# Altium project motherboard2.PrjPcb
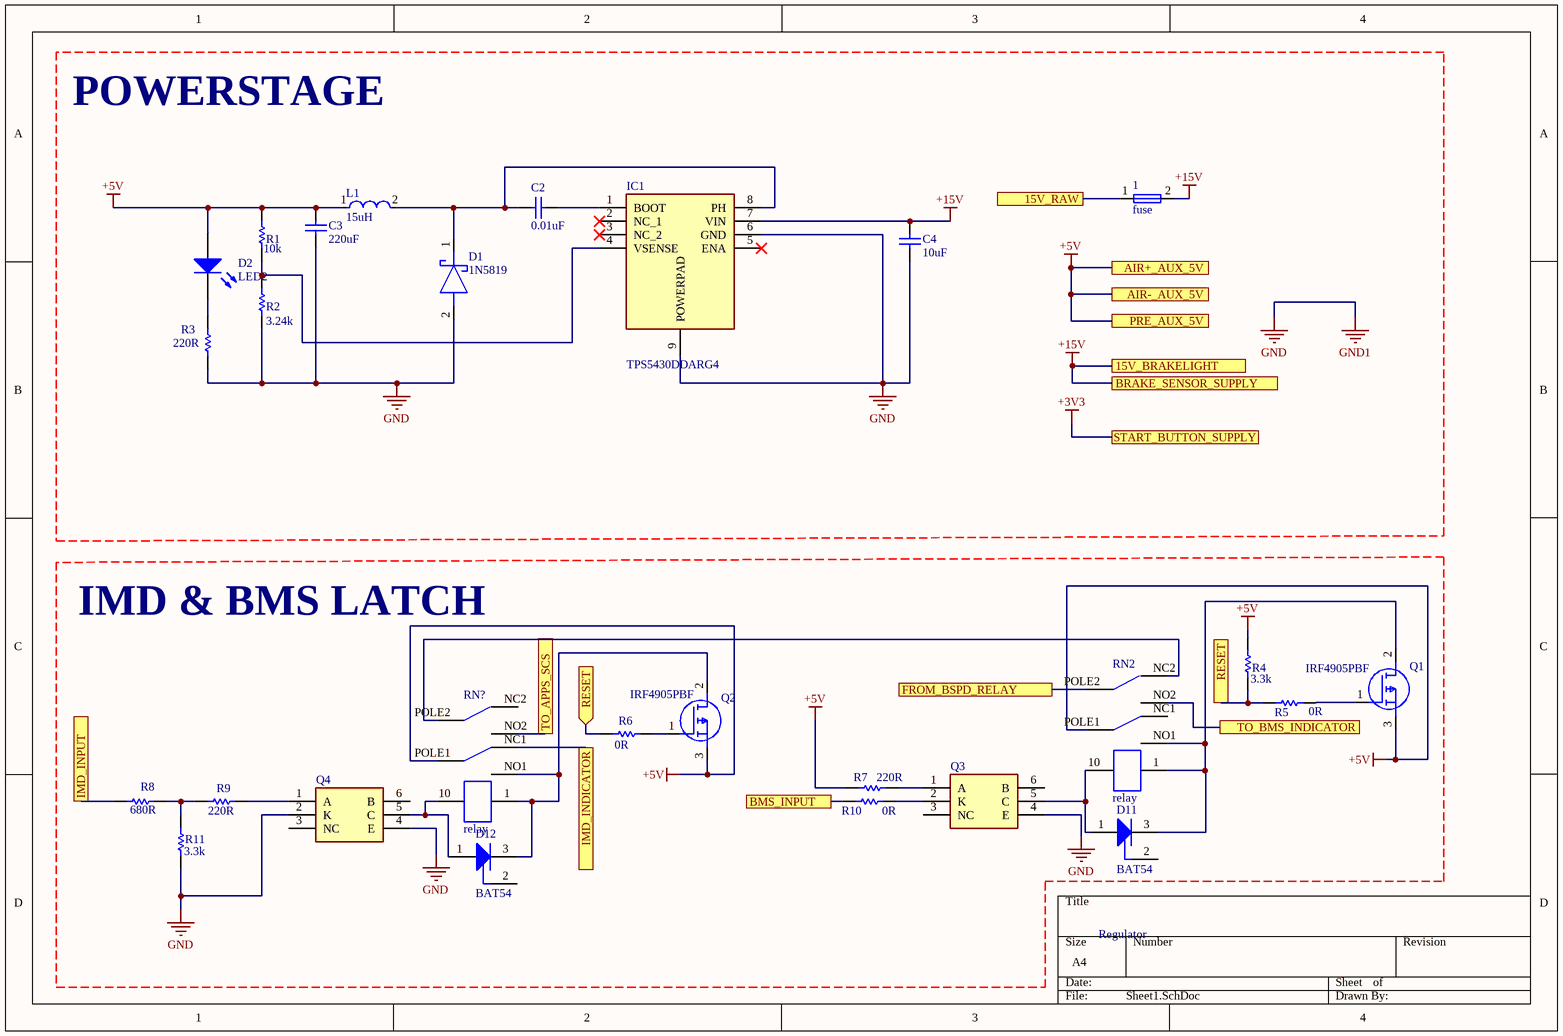
[diagram p0: Sheet1.SchDoc]
5 sheets, 112 parts. Net scope: flat (ports and power ports of the same name join across sheets).
Board file: PCB1.PcbDoc
Sheets:
  Sheet1.SchDoc
  Sheet2.SchDoc
  Sheet3.SchDoc
  Sheet4.SchDoc
  Sheet5.SchDoc

## Sheet Sheet1.SchDoc
size A4

### Parts
1  fuse  [fuse]
C2  0.01uF  [KEMT-1206-2_N]
C3  220uF  [KEMT-1206-2_N]
C4  10uF  [KEMT-1206-2_N]
D1  1N5819  [DIOAD1796W86L628D292]
D2  LED2  [3.2X1.6X1.1]
D11  BAT54  [INF-SOT23_N]
D12  BAT54  [INF-SOT23_N]
IC1  TPS5430DDARG4  [SOIC127P600X175-8N]
L1  15uH  [FP-IR02-MFG]
Q1  IRF4905PBF  [TO254P469X1042X1967-3P]
Q2  IRF4905PBF  [TO254P469X1042X1967-3P]
Q3  MCT2ESM  [SOT254P916X480-6N]  (value not drawn)
Q4  MCT2ESM  [SOT254P916X480-6N]  (value not drawn)
R1  10k  [RESC3216X60X45NL10T20 - duplicate]
R2  3.24k  [RESC3216X60X45NL10T20 - duplicate]
R3  220R  [RESC3216X60X45NL10T20 - duplicate]
R4  3.3k  [RESC3216X60X45NL10T20 - duplicate]
R5  0R  [RESC3216X60X45NL10T20 - duplicate]
R6  0R  [RESC3216X60X45NL10T20 - duplicate]
R7  220R  [RESC3216X60X45NL10T20 - duplicate]
R8  680R  [RESC3216X60X45NL10T20 - duplicate]
R9  220R  [RESC3216X60X45NL10T20 - duplicate]
R10  0R  [RESC3216X60X45NL10T20 - duplicate]
R11  3.3k  [RESC3216X60X45NL10T20 - duplicate]
RN2  relay  [relaytq]
RN?  relay  [relaytq]

### Blocks framed on the sheet
POWERSTAGE: 1 C2-C4 D1 D2 IC1 L1 R1-R3
IMD & BMS LATCH: D11 D12 Q1-Q4 R4-R11 RN2 RN?

### Ports
15V_BRAKELIGHT, 15V_RAW, AIR+_AUX_5V, AIR-_AUX_5V, BMS_INPUT, BRAKE_SENSOR_SUPPLY, FROM_BSPD_RELAY, IMD_INDICATOR, IMD_INPUT, PRE_AUX_5V, RESET, RESET (in), START_BUTTON_SUPPLY, TO_APPS_SCS, TO_BMS_INDICATOR

### Nets
+5V: C3.1 D2.1(A) L1.1 Q1.3(S) Q2.3(S) R1.2 R4.2 R7.2 RN?.POLE1 ; port AIR+_AUX_5V, port AIR-_AUX_5V, port PRE_AUX_5V
+15V: 1.2 C4.1 IC1.7(VIN) ; port BRAKE_SENSOR_SUPPLY, port 15V_BRAKELIGHT
GND: C3.2 C4.2 D1.2(A) IC1.6(GND) IC1.9(POWERPAD) Q3.4(E) Q4.2(K) Q4.4(E) R2.1 R3.1 R11.1  [also labelled GND1]
Net1_1: 1.1 ; port 15V_RAW
NetC2_1: C2.1 D1.1(K) IC1.8(PH) L1.2
NetC2_2: C2.2 IC1.1(BOOT)
NetD2_2: D2.2(K) R3.2
NetD11_1: D11.1(A) Q3.5(C) RN2.10
NetD11_3: D11.3(K) Q1.2(D) RN2.1 RN2.NO1
NetD12_1: D12.1(A) Q4.5(C) RN?.10
NetD12_3: D12.3(K) Q2.2(D) RN?.1 RN?.NO1
NetIC1_4: IC1.4(VSENSE) R1.1 R2.2
NetJ1_47: R10.2 ; port BMS_INPUT
NetJ1_50: RN2.NO2 ; port TO_BMS_INDICATOR
NetJ1_52: RN?.NC1 ; port IMD_INDICATOR
NetJ1_53: RN2.POLE2 ; port FROM_BSPD_RELAY
NetJ1_54: R4.1 R5.2 R6.2 ; port RESET
NetJ1_55: R8.2 ; port IMD_INPUT
NetQ1_1: Q1.1(G) R5.1
NetQ2_1: Q2.1(G) R6.1
NetQ3_1: Q3.1(A) R7.1
NetQ3_2: Q3.2(K) R10.1
NetQ4_1: Q4.1(A) R9.1
NetR8_1: R8.1 R9.2 R11.2
NetRN2_NC2: RN2.NC2 RN?.POLE2
NetRN3_POLE1: RN?.NO2 ; port TO_APPS_SCS

Not connected (* = marked no-connect by the designer): D11 2(NC); D12 2(NC); IC1 2(NC_1)* 3(NC_2)* 5(ENA)*; Q3 3(NC) 6(B); Q4 3(NC) 6(B); RN2 NC1 POLE1; RN? NC2

### Notes on the sheet
- Regulator

### Library data of the parts
C2-C4 = CMP-1037-04202-2: CAP, Ceramic, 0.1 uF, +/- 10%, 50 V, -55 to 125 degC, 1206 (3216 Metric), RoHS, Tape and Reel; Manufacturer: Kemet; Voltage Rating: 50V; Capacitance: 0.1µF; Product Range: KEMET-CSeries; SVHC: ToBeAdvised; Dielectric Characteristic: X7R; Capacitor Case Style: 1206[3216Metric]; Package Reference: 1206-2; Package Description: 2-Leads SMD, Body 3.2 x 1.6 mm; Packaging: Tape&Reel; Operating Temperature Max: 125degC; Capacitance Tolerance: ±10%; Datasheet URL: https://datasheet.ciiva.com/6125/1725438-6125494.pdf; Manufacturer URL: http://www.kemet.com/; Operating Temperature Min: -55degC; Datasheet Version: Jul-13
D1 = 1N5819: Schottky Diode; Manufacturer_Name: NEUTRAL; Datasheet Link: http://uk.rs-online.com/web/p/products/1124416; Manufacturer_Part_Number: 1N5819
D2 = LED2: Typical RED, GREEN, YELLOW, AMBER GaAs LED; Published: 8-Jun-2000; LatestRevisionDate: 17-Jul-2002; LatestRevisionNote: Re-released for DXP Platform.; PackageVersion: Feb-2002; PackageReference: 3.2X1.6X1.1; Publisher: Altium Limited; PackageDescription: SM LED; 2 Flat Leads
D11 D12 = CMP-1182-00010-1: Silicon Schottky Diode, SOT23, Reel, Green; Manufacturer: Infineon; VF (max): 800Â mV; Configuration: Single; IF (max): 200Â mA; CT (max): 10Â pF; Green: TRUE; VR (max): 30Â V; PartNumber: BAT54; ComponentLink2URL: http://www.infineon.com/dgdl/bat54series.pdf?folderId=db3a30431400ef68011425f1ca2505e3&fileId=db3a304314dca3890115190b74210ea6; ComponentLink3Description: Package Specification; PackageVersion: Apr-08; PackageDescription: 3-Pin Small Outline Transistor Package, 1.3 x 2.9 mm Body, 0.95 mm Pitch; ComponentLink1Description: Manufacturer URL; ComponentLink1URL: http://www.infineon.com/; Mounting Technology: Surface Mount; Packing: Reel; ComponentLink2Description: Datasheet; PackageReference: SOT23; ComponentLink3URL: http://www.infineon.com/dgdl/SOT23-Package_Overview.pdf?folderId=db3a30431936bc4b0119532290053c66&fileId=db3a30431936bc4b0119533468123c85
IC1 = TPS5430DDARG4: Integrated Circuit; Manufacturer_Name: Texas Instruments; Datasheet Link: http://www.ti.com/general/docs/suppproductinfo.tsp?distId=10&gotoUrl=http%3A%2F%2Fwww.ti.com%2Flit%2Fgpn%2Ftps5431; Height: 1.7mm; Manufacturer_Part_Number: TPS5430DDARG4; Mouser Part Number: 595-TPS5430DDARG4; Mouser Price/Stock: https://www.mouser.co.uk/ProductDetail/Texas-Instruments/TPS5430DDARG4?qs=zwk82MlA57YG4K%2FfUMTveg%3D%3D
L1 = CMP-03630-000001-1: IR-2 10 10% B08; Obsolete Part: true; Manufacturer: Vishay Dale; Manufacturer Part Number: IR02BH100K; Core Material: Iron; Value: 10uH; Test Frequency: 7.9MHz; Saturation Current: 130mA; Series Resistance: 3.7Ω; Q Factor: 55; Self Resonant Frequency: 50MHz; Device Class L2: Inductors; ComponentLink2Description: Datasheet; Temperature Range Low: -55°C; Digikey Description: IR-2 10 10% B08; Temperature Range High: +105°C; Inductance: 10uH; Height: 3.05mm; Package: IR02; Tolerance: 10%; Device Class L1: Passive Components; Category: Ind; Device Class L3: Fixed Inductors; RoHS: TRUE; Octopart: https://octopart.com/ir02bh100k-vishay+dale-39675774; Temperature: -55°C to +105°C; Ipc Land Pattern Name: CAPAD1147W70L838D305; Lead Free: Yes; ComponentLink2URL: https://datasheet.ciiva.com/8536/ir-8536517.pdf; Automotive: No; Mouser Description: Fixed Inductors 10uH 10%
Q1 Q2 = IRF4905PBF: MOSFET (P-Channel); Manufacturer_Name: Infineon; Datasheet Link: http://docs-emea.rs-online.com/webdocs/0791/0900766b807910f2.pdf; Height: 4.69mm; Manufacturer_Part_Number: IRF4905PBF; Mouser Part Number: 942-IRF4905PBF; Mouser Price/Stock: https://www.mouser.co.uk/ProductDetail/Infineon-IR/IRF4905PBF/?qs=9%252BKlkBgLFf39l0HsWdxvdw%3D%3D; Arrow Part Number: IRF4905PBF; Arrow Price/Stock: https://www.arrow.com/en/products/irf4905pbf/infineon-technologies-ag
Q3 Q4 = MCT2ESM: Phototransistor; Manufacturer_Name: ON Semiconductor; Datasheet Link: https://www.onsemi.com/pub/Collateral/MCT2EM-D.PDF; Height: 4.8mm; Manufacturer_Part_Number: MCT2ESM; Mouser Part Number: 512-MCT2ESM; Mouser Price/Stock: https://www.mouser.co.uk/ProductDetail/ON-Semiconductor-Fairchild/MCT2ESM/?qs=nW0pe8qlIZjLnc6UyUzYTw%3D%3D; Arrow Part Number: MCT2ESM; Arrow Price/Stock: https://www.arrow.com/en/products/mct2esm/on-semiconductor
R1-R11 = CMP-2003-02213-1: Part Number: CRCW120647K0FKEA; Manufacturer: Vishay Dale

## Sheet Sheet2.SchDoc
size A4
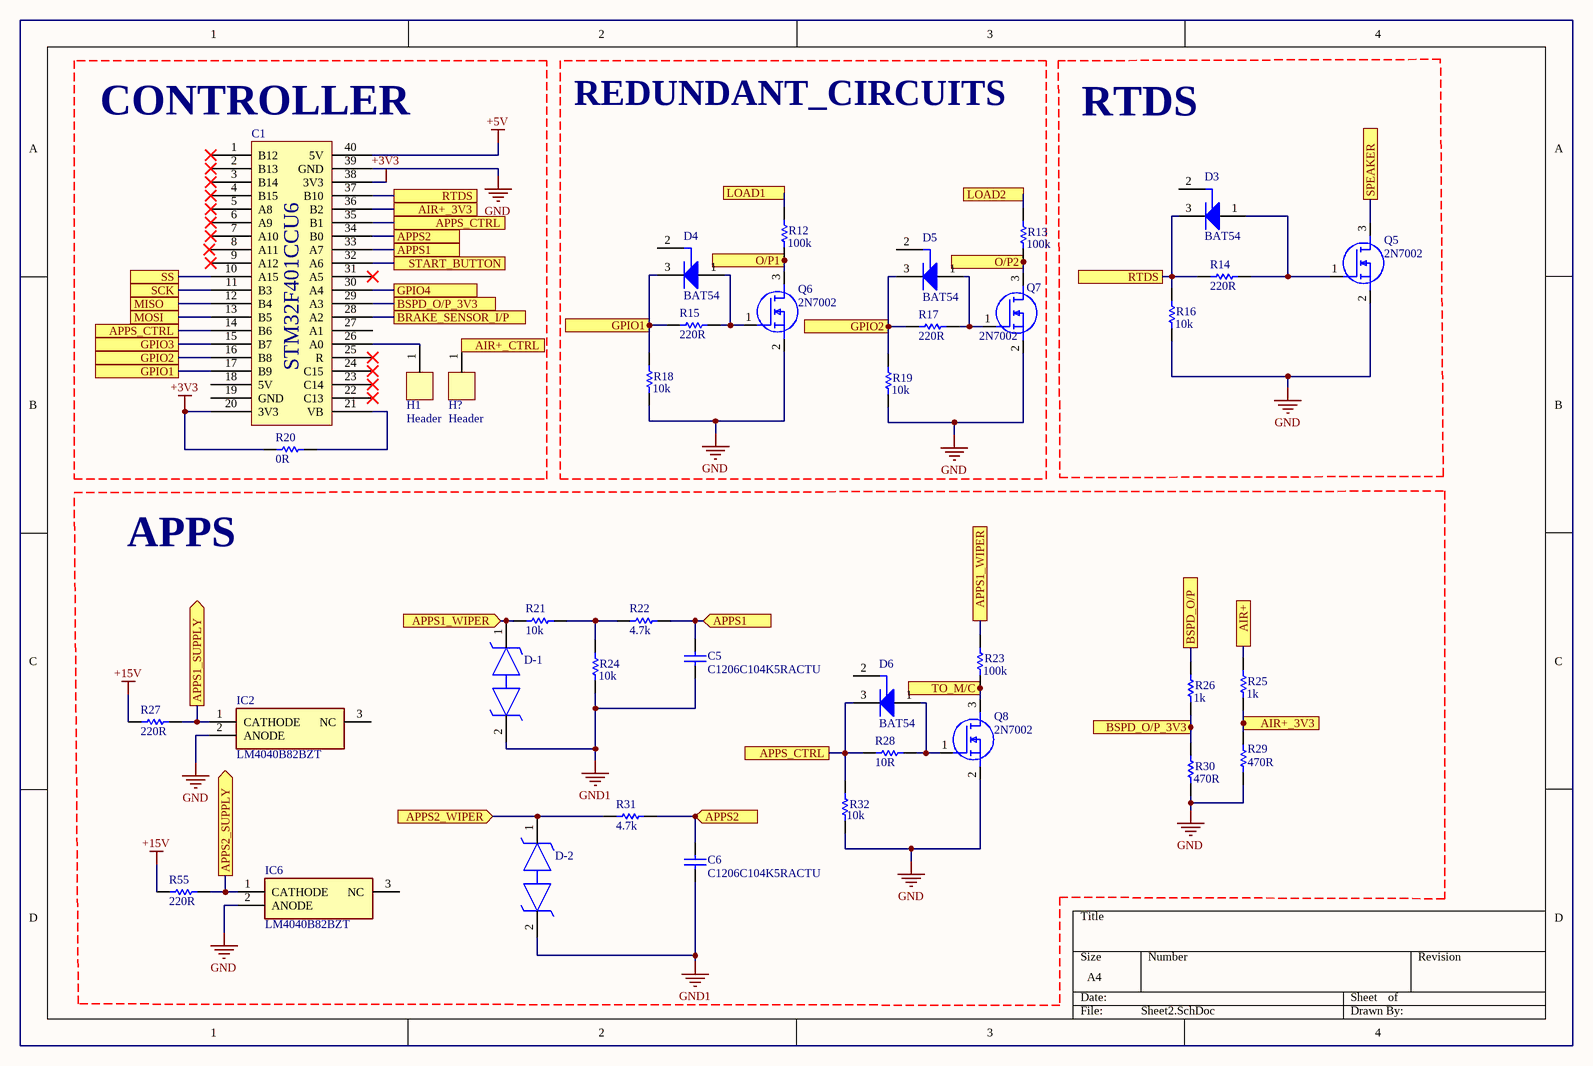
[diagram p1: Sheet2.SchDoc]

### Parts
C1  Component_1  [PCBComponent_1]  (value not drawn)
C5  C1206C104K5RACTU  [KEMT-1206-2_N]
C6  C1206C104K5RACTU  [KEMT-1206-2_N]
D3  BAT54  [INF-SOT23_N]
D4  BAT54  [INF-SOT23_N]
D5  BAT54  [INF-SOT23_N]
D6  BAT54  [INF-SOT23_N]
D-1  TPD1E6B06DPLR  [R1206]  (value not drawn)
D-2  TPD1E6B06DPLR  [R1206]  (value not drawn)
H1  Header  [Header]
H2  Header  [Header]
IC2  LM4040B82BZT  [SOT95P237X112-3N]
IC6  LM4040B82BZT  [SOT95P237X112-3N]
Q5  2N7002  [SOT96P240X120-3N]
Q6  2N7002  [SOT96P240X120-3N]
Q7  2N7002  [SOT96P240X120-3N]
Q8  2N7002  [SOT96P240X120-3N]
R12  100k  [RESC3216X60X45NL10T20 - duplicate]
R13  100k  [RESC3216X60X45NL10T20 - duplicate]
R14  220R  [RESC3216X60X45NL10T20 - duplicate]
R15  220R  [RESC3216X60X45NL10T20 - duplicate]
R16  10k  [RESC3216X60X45NL10T20 - duplicate]
R17  220R  [RESC3216X60X45NL10T20 - duplicate]
R18  10k  [RESC3216X60X45NL10T20 - duplicate]
R19  10k  [RESC3216X60X45NL10T20 - duplicate]
R20  0R  [R1206]
R21  10k  [RESC3216X60X45NL10T20 - duplicate]
R22  4.7k  [RESC3216X60X45NL10T20 - duplicate]
R23  100k  [RESC3216X60X45NL10T20 - duplicate]
R24  10k  [RESC3216X60X45NL10T20 - duplicate]
R25  1k  [RESC3216X60X45NL10T20 - duplicate]
R26  1k  [RESC3216X60X45NL10T20 - duplicate]
R27  220R  [RESC3216X60X45NL10T20 - duplicate]
R28  10R  [RESC3216X60X45NL10T20 - duplicate]
R29  470R  [R1206]
R30  470R  [RESC3216X60X45NL10T20 - duplicate]
R31  4.7k  [RESC3216X60X45NL10T20 - duplicate]
R32  10k  [RESC3216X60X45NL10T20 - duplicate]
R55  220R  [RESC3216X60X45NL10T20 - duplicate]

### Blocks framed on the sheet
CONTROLLER: C1 H1 H2 R20
REDUNDANT_CIRCUITS: D4 D5 Q6 Q7 R12 R13 R15 R17-R19
APPS: C5 C6 D6 D-1 D-2 IC2 IC6 Q8 R21-R32 R55

### Ports
AIR+, AIR+_3V3, AIR+_CTRL, APPS1, APPS1 (in), APPS1_SUPPLY (out), APPS1_WIPER, APPS1_WIPER (in), APPS2, APPS2 (in), APPS2_SUPPLY (out), APPS2_WIPER (in), APPS_CTRL, BRAKE_SENSOR_I/P, BSPD_O/P, BSPD_O/P_3V3, GPIO1, GPIO2, GPIO3, GPIO4, LOAD1, LOAD2, MISO, MOSI, O/P1, O/P2, RTDS, SCK, SPEAKER, SS, START_BUTTON, TO_M/C

### Nets
+3V3: C1.20(3V3) C1.38(3V3) R20.1
+5V: C1.40(5V)
+15V: R27.2 R55.2
GND: C1.39(GND) C5.1 C6.1 D-1.2 D-2.2 IC2.2(ANODE) IC6.2(ANODE) Q5.2(S) Q6.2(S) Q7.2(S) Q8.2(S) R16.1 R18.1 R19.1 R24.1 R29.1 R30.1 R32.1  [also labelled GND1]
NetC1_10: C1.10(A15) ; port SS
NetC1_11: C1.11(B3) ; port SCK
NetC1_12: C1.12(B4) ; port MISO
NetC1_13: C1.13(B5) ; port MOSI
NetC1_14: C1.14(B6) C1.35(B1) D6.3(K) R28.2 R32.2 ; port APPS_CTRL
NetC1_15: C1.15(B7) ; port GPIO3
NetC1_16: C1.16(B8) D5.3(K) R17.2 R19.2 ; port GPIO2
NetC1_17: C1.17(B9) D4.3(K) R15.2 R18.2 ; port GPIO1
NetC1_21: C1.21(VB) R20.2
NetC1_26: C1.26(A0) H1.1
NetC1_28: C1.28(A2) ; port BRAKE_SENSOR_I/P
NetC1_29: C1.29(A3) R26.1 R30.2 ; port BSPD_O/P_3V3
NetC1_30: C1.30(A4) ; port GPIO4
NetC1_32: C1.32(A6) ; port START_BUTTON
NetC1_33: C1.33(A7) C5.2 R22.1 ; port APPS1
NetC1_34: C1.34(B0) C6.2 R31.1 ; port APPS2
NetC1_36: C1.36(B2) R25.1 R29.2 ; port AIR+_3V3
NetC1_37: C1.37(B10) D3.3(K) R14.2 R16.2 ; port RTDS
NetD3_1: D3.1(A) Q5.1(G) R14.1
NetD4_1: D4.1(A) Q6.1(G) R15.1
NetD5_1: D5.1(A) Q7.1(G) R17.1
NetD6_1: D6.1(A) Q8.1(G) R28.1
NetD-1_1: D-1.1 R21.2 R23.2 ; port APPS1_WIPER
NetD-2_1: D-2.1 R31.2 ; port APPS2_WIPER
NetH2_1: H2.1 ; port AIR+_CTRL
NetIC2_1: IC2.1(CATHODE) R27.1 ; port APPS1_SUPPLY
NetIC6_1: IC6.1(CATHODE) R55.1 ; port APPS2_SUPPLY
NetJ1_22: Q5.3(D) ; port SPEAKER
NetJ1_24: R26.2 ; port BSPD_O/P
NetJ1_29: Q8.3(D) R23.1 ; port TO_M/C
NetJ1_34: R12.2 ; port LOAD1
NetJ1_38: R13.2 ; port LOAD2
NetJ1_39: Q7.3(D) R13.1 ; port O/P2
NetJ1_40: Q6.3(D) R12.1 ; port O/P1
NetJ2_3: R25.2 ; port AIR+
NetR21_1: R21.1 R22.2 R24.2

Not connected (* = marked no-connect by the designer): C1 1(B12)* 2(B13)* 3(B14)* 4(B15)* 5(A8)* 6(A9)* 7(A10)* 8(A11) 9(A12)* 18(5V) 19(GND) 22(C13)* 23(C14)* 24(C15)* 25(R)* 27(A1) 31(A5)*; D3 2(NC); D4 2(NC); D5 2(NC); D6 2(NC); IC2 3(NC); IC6 3(NC)

### Notes on the sheet
- RTDS
- (in symbol Component_1) STM32F401CCU6

### Library data of the parts
C5 C6 = CMP-1037-04202-2: as C2 on sheet Sheet1; Package Reference: 1206-2; Package Description: 2-Leads SMD, Body 3.2 x 1.6 mm; Packaging: Tape&Reel; Operating Temperature Max: 125degC; Capacitance Tolerance: ±10%; Datasheet URL: https://datasheet.ciiva.com/6125/1725438-6125494.pdf; Manufacturer URL: http://www.kemet.com/; Operating Temperature Min: -55degC; Datasheet Version: Jul-13
D3-D6 = CMP-1182-00010-1: as D11 on sheet Sheet1; PartNumber: BAT54; ComponentLink2URL: http://www.infineon.com/dgdl/bat54series.pdf?folderId=db3a30431400ef68011425f1ca2505e3&fileId=db3a304314dca3890115190b74210ea6; ComponentLink3Description: Package Specification; PackageVersion: Apr-08; PackageDescription: 3-Pin Small Outline Transistor Package, 1.3 x 2.9 mm Body, 0.95 mm Pitch; ComponentLink1Description: Manufacturer URL; ComponentLink1URL: http://www.infineon.com/; Mounting Technology: Surface Mount; Packing: Reel; ComponentLink2Description: Datasheet; PackageReference: SOT23; ComponentLink3URL: http://www.infineon.com/dgdl/SOT23-Package_Overview.pdf?folderId=db3a30431936bc4b0119532290053c66&fileId=db3a30431936bc4b0119533468123c85
IC2 IC6 = LM4040B25IDBZT: Integrated Circuit; Manufacturer_Name: Texas Instruments; Datasheet Link: https://www.ti.com/lit/gpn/LM4040; Height: 1.12mm; Manufacturer_Part_Number: LM4040B25IDBZT; Mouser Part Number: 595-LM4040B25IDBZT; Mouser Price/Stock: https://www.mouser.com/Search/Refine.aspx?Keyword=595-LM4040B25IDBZT; Arrow Part Number: LM4040B25IDBZT; Arrow Price/Stock: https://www.arrow.com/en/products/lm4040b25idbzt/texas-instruments
Q5-Q8 = 2N7002: MOSFET (N-Channel); Manufacturer_Name: Vishay; Datasheet Link: https://www.diodes.com/assets/Datasheets/ds11303.pdf; Height: 1.2mm; Manufacturer_Part_Number: 2N7002; Mouser Part Number: 781-2N7002; Mouser Price/Stock: https://www.mouser.co.uk/ProductDetail/Vishay-Siliconix/2N7002?qs=xBpwZ0JX2zKeuvZKtdYLZQ%3D%3D
R12-R19 R21-R28 R30-R32 R55 = CMP-2003-02213-1: as R1 on sheet Sheet1
R20 R29 = RES: Part Number: CRCW120647K0FKEA; Manufacturer: Vishay Dale

## Sheet Sheet3.SchDoc
size A4
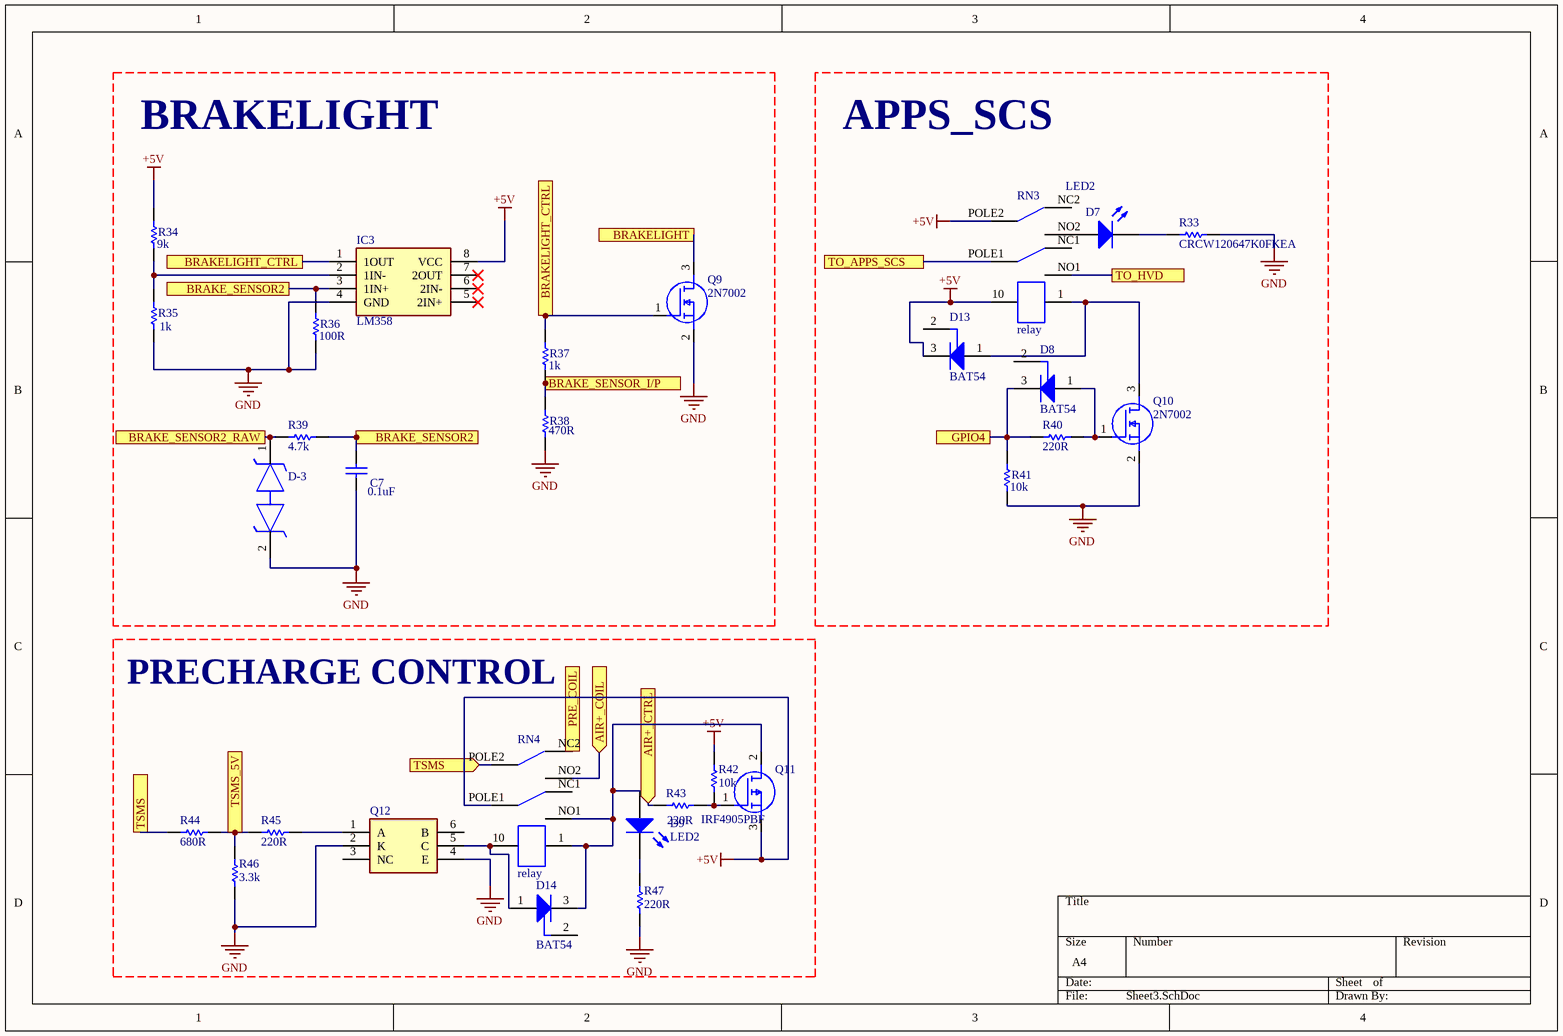
[diagram p2: Sheet3.SchDoc]

### Parts
C7  0.1uF  [KEMT-1206-2_N]
D7  LED2  [3.2X1.6X1.1]
D8  BAT54  [INF-SOT23_N]
D9  LED2  [3.2X1.6X1.1]
D13  BAT54  [INF-SOT23_N]
D14  BAT54  [INF-SOT23_N]
D-3  TPD1E6B06DPLR  [R1206]  (value not drawn)
IC3  LM358  [SOP100P600X150-8N]
Q9  2N7002  [SOT96P240X120-3N]
Q10  2N7002  [SOT96P240X120-3N]
Q11  IRF4905PBF  [TO254P469X1042X1967-3P]
Q12  MCT2ESM  [SOT254P916X480-6N]  (value not drawn)
R33  CRCW120647K0FKEA  [RESC3216X60X45NL10T20 - duplicate]
R34  9k  [RESC3216X60X45NL10T20 - duplicate]
R35  1k  [RESC3216X60X45NL10T20 - duplicate]
R36  100R  [RESC3216X60X45NL10T20 - duplicate]
R37  1k  [RESC3216X60X45NL10T20 - duplicate]
R38  470R  [RESC3216X60X45NL10T20 - duplicate]
R39  4.7k  [RESC3216X60X45NL10T20 - duplicate]
R40  220R  [RESC3216X60X45NL10T20 - duplicate]
R41  10k  [RESC3216X60X45NL10T20 - duplicate]
R42  10k  [R1206]
R43  220R  [R1206]
R44  680R  [RESC3216X60X45NL10T20 - duplicate]
R45  220R  [R1206]
R46  3.3k  [RESC3216X60X45NL10T20 - duplicate]
R47  220R  [R1206]
RN3  relay  [relaytq]
RN4  relay  [relaytq]

### Blocks framed on the sheet
BRAKELIGHT: C7 D-3 IC3 Q9 R34-R39
APPS_SCS: D7 D8 D13 Q10 R33 R40 R41 RN3
PRECHARGE CONTROL: D9 D14 Q11 Q12 R42-R47 RN4

### Ports
AIR+_COIL (in), AIR+_CTRL (in), BRAKE_SENSOR2, BRAKE_SENSOR2_RAW, BRAKE_SENSOR_I/P, BRAKELIGHT, BRAKELIGHT_CTRL, GPIO4, PRE_COIL, TO_APPS_SCS, TO_HVD, TSMS, TSMS (in), TSMS_5V

### Nets
+5V: D13.3(K) IC3.8(VCC) Q11.3(S) R34.2 R42.2 RN3.10 RN3.POLE2 RN4.POLE1
GND: C7.1 D-3.2 IC3.4(GND) Q9.2(S) Q10.2(S) Q12.2(K) Q12.4(E) R33.1 R35.1 R36.1 R38.1 R41.1 R46.1 R47.2
NetC1_28: R37.1 R38.2 ; port BRAKE_SENSOR_I/P
NetC1_30: D8.3(K) R40.2 R41.2 ; port GPIO4
NetC7_2: C7.2 IC3.3(1IN+) R36.2 R39.1 ; port BRAKE_SENSOR2
NetD7_1: D7.1(A) RN3.NO2
NetD7_2: D7.2(K) R33.2
NetD8_1: D8.1(A) Q10.1(G) R40.1
NetD9_1: D9.1(A) D14.3(K) Q11.2(D) RN4.1 RN4.NO1
NetD9_2: D9.2(K) R47.1
NetD13_1: D13.1(A) Q10.3(D) RN3.1
NetD14_1: D14.1(A) Q12.5(C) RN4.10
NetD-3_1: D-3.1 R39.2 ; port BRAKE_SENSOR2_RAW
NetH2_1: R43.1 ; port AIR+_CTRL
NetIC3_1: IC3.1(1OUT) Q9.1(G) R37.2 ; port BRAKELIGHT_CTRL
NetIC3_2: IC3.2(1IN-) R34.1 R35.2
NetJ1_33: Q9.3(D) ; port BRAKELIGHT
NetJ1_42: RN4.NC2 ; port PRE_COIL
NetJ1_46: RN4.NO2 ; port AIR+_COIL
NetJ1_49: RN3.NO1 ; port TO_HVD
NetJ1_56: R44.1 R45.2 R46.2 ; port TSMS_5V
NetJ2_2: R44.2 RN4.POLE2 ; port TSMS
NetQ11_1: Q11.1(G) R42.1 R43.2
NetQ12_1: Q12.1(A) R45.1
NetRN3_POLE1: RN3.POLE1 ; port TO_APPS_SCS

Not connected (* = marked no-connect by the designer): D8 2(NC); D13 2(NC); D14 2(NC); IC3 5(2IN+)* 6(2IN-)* 7(2OUT)*; Q12 3(NC) 6(B); RN3 NC1 NC2; RN4 NC1

### Library data of the parts
C7 = CAPACITOR: CAP, Ceramic, 0.1 uF, +/- 10%, 50 V, -55 to 125 degC, 1206 (3216 Metric), RoHS, Tape and Reel; Manufacturer: Kemet; Voltage Rating: 50V; Capacitance: 0.1µF; Product Range: KEMET-CSeries; SVHC: ToBeAdvised; Dielectric Characteristic: X7R; Capacitor Case Style: 1206[3216Metric]; Package Reference: 1206-2; Package Description: 2-Leads SMD, Body 3.2 x 1.6 mm; Packaging: Tape&Reel; Operating Temperature Max: 125degC; Capacitance Tolerance: ±10%; Datasheet URL: https://datasheet.ciiva.com/6125/1725438-6125494.pdf; Manufacturer URL: http://www.kemet.com/; Operating Temperature Min: -55degC; Datasheet Version: Jul-13
D7 D9 = LED2: as D2 on sheet Sheet1; Published: 8-Jun-2000; LatestRevisionDate: 17-Jul-2002; LatestRevisionNote: Re-released for DXP Platform.; PackageVersion: Feb-2002; PackageReference: 3.2X1.6X1.1; Publisher: Altium Limited; PackageDescription: SM LED; 2 Flat Leads
D8 D13 D14 = CMP-1182-00010-1: as D11 on sheet Sheet1; PartNumber: BAT54; ComponentLink2URL: http://www.infineon.com/dgdl/bat54series.pdf?folderId=db3a30431400ef68011425f1ca2505e3&fileId=db3a304314dca3890115190b74210ea6; ComponentLink3Description: Package Specification; PackageVersion: Apr-08; PackageDescription: 3-Pin Small Outline Transistor Package, 1.3 x 2.9 mm Body, 0.95 mm Pitch; ComponentLink1Description: Manufacturer URL; ComponentLink1URL: http://www.infineon.com/; Mounting Technology: Surface Mount; Packing: Reel; ComponentLink2Description: Datasheet; PackageReference: SOT23; ComponentLink3URL: http://www.infineon.com/dgdl/SOT23-Package_Overview.pdf?folderId=db3a30431936bc4b0119532290053c66&fileId=db3a30431936bc4b0119533468123c85
IC3 = LM358: Integrated Circuit; Manufacturer_Name: IDCHIP; Datasheet Link: https://datasheet.lcsc.com/szlcsc/1902201702_IDCHIP-LM358_C329455.pdf; Height: 1.5mm; Manufacturer_Part_Number: LM358
Q9 Q10 = 2N7002: as Q5 on sheet Sheet2; Datasheet Link: https://www.diodes.com/assets/Datasheets/ds11303.pdf; Height: 1.2mm; Manufacturer_Part_Number: 2N7002; Mouser Part Number: 781-2N7002; Mouser Price/Stock: https://www.mouser.co.uk/ProductDetail/Vishay-Siliconix/2N7002?qs=xBpwZ0JX2zKeuvZKtdYLZQ%3D%3D
Q11 = IRF4905PBF: as Q1 on sheet Sheet1; Datasheet Link: http://docs-emea.rs-online.com/webdocs/0791/0900766b807910f2.pdf; Height: 4.69mm; Manufacturer_Part_Number: IRF4905PBF; Mouser Part Number: 942-IRF4905PBF; Mouser Price/Stock: https://www.mouser.co.uk/ProductDetail/Infineon-IR/IRF4905PBF/?qs=9%252BKlkBgLFf39l0HsWdxvdw%3D%3D; Arrow Part Number: IRF4905PBF; Arrow Price/Stock: https://www.arrow.com/en/products/irf4905pbf/infineon-technologies-ag
Q12 = MCT2ESM: as Q3 on sheet Sheet1; Datasheet Link: https://www.onsemi.com/pub/Collateral/MCT2EM-D.PDF; Height: 4.8mm; Manufacturer_Part_Number: MCT2ESM; Mouser Part Number: 512-MCT2ESM; Mouser Price/Stock: https://www.mouser.co.uk/ProductDetail/ON-Semiconductor-Fairchild/MCT2ESM/?qs=nW0pe8qlIZjLnc6UyUzYTw%3D%3D; Arrow Part Number: MCT2ESM; Arrow Price/Stock: https://www.arrow.com/en/products/mct2esm/on-semiconductor
R33 = CMP-2003-02213-1: Manufacturer: Vishay Dale; Part Number: CRCW120647K0FKEA
R34-R41 R44 R46 = CMP-2003-02213-1: as R1 on sheet Sheet1
R42 R43 R45 R47 = RES: as R20 on sheet Sheet2

## Sheet Sheet4.SchDoc
size A4
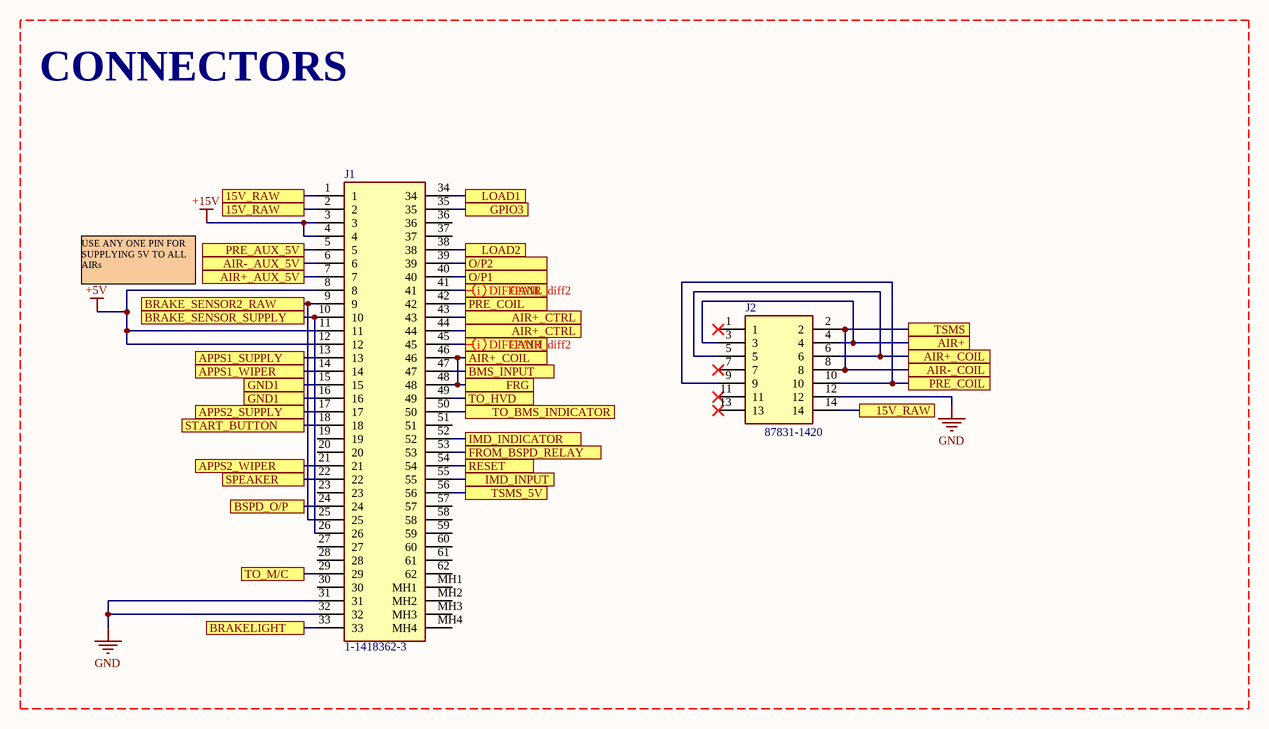
[diagram p3: Sheet4.SchDoc]

### Parts
J1  1-1418362-3  [114183623]
J2  87831-1420  [SHDR14W55P200_2X7_1665X630X640P]

### Blocks framed on the sheet
CONNECTORS: J1 J2

### Ports
15V_RAW, AIR+, AIR+_AUX_5V, AIR+_COIL, AIR+_CTRL, AIR-_AUX_5V, AIR-_COIL, APPS1_SUPPLY, APPS1_WIPER, APPS2_SUPPLY, APPS2_WIPER, BMS_INPUT, BRAKE_SENSOR2_RAW, BRAKE_SENSOR_SUPPLY, BRAKELIGHT, BSPD_O/P, CANH, CANL, FRG, FROM_BSPD_RELAY, GND1, GPIO3, IMD_INDICATOR, IMD_INPUT, LOAD1, LOAD2, O/P1, O/P2, PRE_AUX_5V, PRE_COIL, RESET, SPEAKER, START_BUTTON, TO_BMS_INDICATOR, TO_HVD, TO_M/C, TSMS, TSMS_5V

### Nets
+5V: J1.5 J1.6 J1.7 J1.8 J1.11 J1.12 ; port AIR+_AUX_5V, port AIR-_AUX_5V, port PRE_AUX_5V
+15V: J1.3 J1.4 J1.10 J1.26 ; port BRAKE_SENSOR_SUPPLY
GND: J1.31 J1.32 J2.12
DIFF_N: J1.41 ; port CANL
DIFF_P: J1.45 ; port CANH
Net1_1: J1.1 J1.2 J2.14 ; port 15V_RAW
NetC1_15: J1.35 ; port GPIO3
NetC1_32: J1.18 ; port START_BUTTON
NetD-1_1: J1.14 ; port APPS1_WIPER
NetD-2_1: J1.21 ; port APPS2_WIPER
NetD-3_1: J1.9 J1.25 ; port BRAKE_SENSOR2_RAW
NetH2_1: J1.43 J1.44 ; port AIR+_CTRL
NetIC2_1: J1.13 ; port APPS1_SUPPLY
NetIC6_1: J1.17 ; port APPS2_SUPPLY
NetJ1_15: J1.15 J1.16 ; port GND1
NetJ1_22: J1.22 ; port SPEAKER
NetJ1_24: J1.24 ; port BSPD_O/P
NetJ1_29: J1.29 ; port TO_M/C
NetJ1_33: J1.33 ; port BRAKELIGHT
NetJ1_34: J1.34 ; port LOAD1
NetJ1_38: J1.38 ; port LOAD2
NetJ1_39: J1.39 ; port O/P2
NetJ1_40: J1.40 ; port O/P1
NetJ1_42: J1.42 J2.9 J2.10 ; port PRE_COIL
NetJ1_46: J1.46 J1.48 J2.5 J2.6 ; port AIR+_COIL, port FRG
NetJ1_47: J1.47 ; port BMS_INPUT
NetJ1_49: J1.49 ; port TO_HVD
NetJ1_50: J1.50 ; port TO_BMS_INDICATOR
NetJ1_52: J1.52 ; port IMD_INDICATOR
NetJ1_53: J1.53 ; port FROM_BSPD_RELAY
NetJ1_54: J1.54 ; port RESET
NetJ1_55: J1.55 ; port IMD_INPUT
NetJ1_56: J1.56 ; port TSMS_5V
NetJ2_2: J2.2 J2.8 ; port AIR-_COIL, port TSMS
NetJ2_3: J2.3 J2.4 ; port AIR+

Not connected (* = marked no-connect by the designer): J1 19 20 23 27 28 30 36 37 51 57 58 59 60 61 62 MH1 MH2 MH3 MH4; J2 1* 7* 11* 13*

### Layout directives
differential pair; differential pair class *: DIFF_N, DIFF_P

### Notes on the sheet
- USE ANY ONE PIN FOR SUPPLYING 5V TO ALL AIRs

### Library data of the parts
J1 = 1-1418362-3: Connector; Manufacturer_Name: TE Connectivity; Datasheet Link: https://www.arrow.com/en/products/1-1418362-3/te-connectivity; Height: 48mm; Manufacturer_Part_Number: 1-1418362-3; Mouser Part Number: 571-1-1418362-3; Mouser Price/Stock: https://www.mouser.co.uk/ProductDetail/TE-Connectivity-AMP/1-1418362-3?qs=J7fCQMU5Gej7aVw8AejcvQ%3D%3D; Arrow Part Number: 1-1418362-3; Arrow Price/Stock: https://www.arrow.com/en/products/1-1418362-3/te-connectivity
J2 = 87831-1420: Connector; Manufacturer_Name: Molex; Datasheet Link: http://docs-emea.rs-online.com/webdocs/150d/0900766b8150deae.pdf; Height: 6.4mm; Manufacturer_Part_Number: 87831-1420; Mouser Part Number: 538-87831-1420; Mouser Price/Stock: https://www.mouser.co.uk/ProductDetail/Molex/87831-1420/?qs=QtQX4uD3c2VDCL534TqpVg%3D%3D

## Sheet Sheet5.SchDoc
size A4
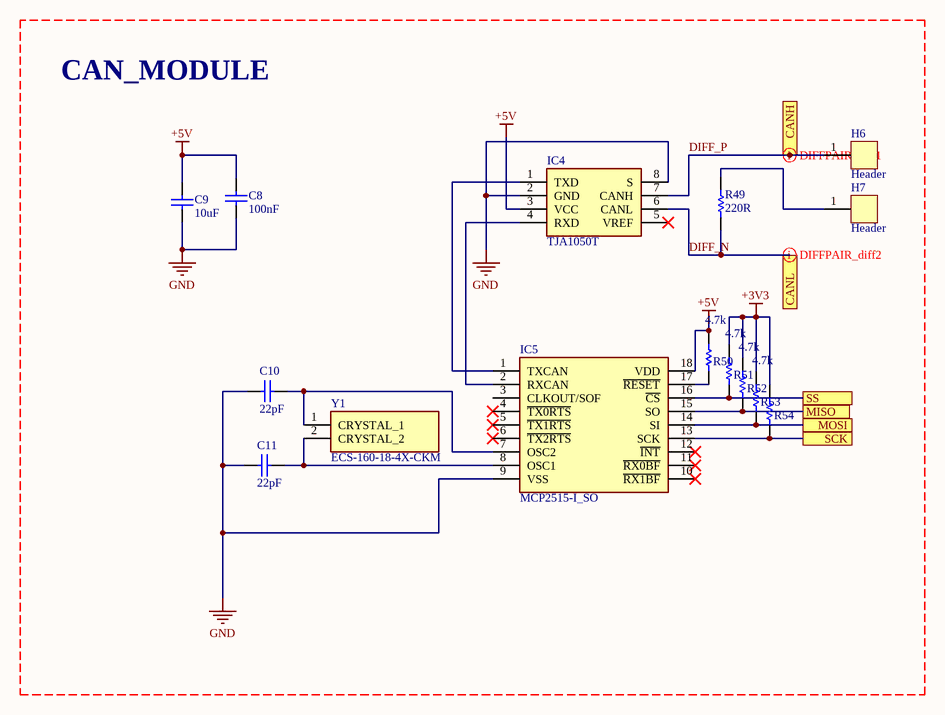
[diagram p4: Sheet5.SchDoc]

### Parts
C8  100nF  [KEMT-1206-2_N]
C9  10uF  [KEMT-1206-2_N]
C10  22pF  [KEMT-1206-2_N]
C11  22pF  [KEMT-1206-2_N]
H6  Header  [Header]
H7  Header  [Header]
IC4  TJA1050T  [SOIC127P600X175-8N]
IC5  MCP2515-I_SO  [SOIC127P1030X265-18N]
R49  220R  [R1206]
R50  4.7k  [R1206]
R51  4.7k  [R1206]
R52  4.7k  [R1206]
R53  4.7k  [R1206]
R54  4.7k  [R1206]  (value not drawn)
Y1  ECS-160-18-4X-CKM  [ECS160184XCKM]

### Blocks framed on the sheet
CAN_MODULE: C8-C11 H6 H7 IC4 IC5 R49-R54 Y1

### Ports
CANH, CANL, MISO, MOSI, SCK, SS

### Nets
+3V3: R51.1 R52.1 R53.1 R54.1
+5V: C8.1 C9.1 IC4.3(VCC) IC5.18(VDD) R50.1
GND: C8.2 C9.2 C10.2 C11.2 IC4.2(GND) IC4.8(S) IC5.9(VSS)
DIFF_N: IC4.6(CANL) R49.1 ; port CANL
DIFF_P: H6.1 IC4.7(CANH) ; port CANH
NetC1_10: IC5.16(~{CS}) R51.2 ; port SS
NetC1_11: IC5.13(SCK) R54.2 ; port SCK
NetC1_12: IC5.15(SO) R52.2 ; port MISO
NetC1_13: IC5.14(SI) R53.2 ; port MOSI
NetC10_1: C10.1 IC5.7(OSC2) Y1.1(CRYSTAL_1)
NetC11_1: C11.1 IC5.8(OSC1) Y1.2(CRYSTAL_2)
NetH7_1: H7.1 R49.2
NetIC4_1: IC4.1(TXD) IC5.1(TXCAN)
NetIC4_4: IC4.4(RXD) IC5.2(RXCAN)
NetIC5_17: IC5.17(~{RESET}) R50.2

Not connected (* = marked no-connect by the designer): IC4 5(VREF)*; IC5 3(CLKOUT/SOF) 4(~{TX0RTS})* 5(~{TX1RTS})* 6(~{TX2RTS})* 10(~{RX1BF})* 11(~{RX0BF})* 12(~{INT})*

### Layout directives
differential pair; differential pair class *: DIFF_N, DIFF_P

### Library data of the parts
C8-C11 = CMP-1037-04202-2: as C2 on sheet Sheet1; Package Reference: 1206-2; Package Description: 2-Leads SMD, Body 3.2 x 1.6 mm; Packaging: Tape&Reel; Operating Temperature Max: 125degC; Capacitance Tolerance: ±10%; Datasheet URL: https://datasheet.ciiva.com/6125/1725438-6125494.pdf; Manufacturer URL: http://www.kemet.com/; Operating Temperature Min: -55degC; Datasheet Version: Jul-13
IC4 = TJA1050T: Integrated Circuit; Manufacturer_Name: Nexperia; Datasheet Link: http://docs-emea.rs-online.com/webdocs/0425/0900766b80425301.pdf; Height: 1.75mm; Manufacturer_Part_Number: TJA1050T; Mouser Part Number: N/A; Mouser Price/Stock: https://www.mouser.com/Search/Refine.aspx?Keyword=N%2FA
IC5 = MCP2515-I_SO: Integrated Circuit; Manufacturer_Name: Microchip; Manufacturer_Part_Number: MCP2515-I/SO; Datasheet Link: http://ww1.microchip.com/downloads/en/DeviceDoc/21801G.pdf; Height: 2.65mm; Mouser Part Number: 579-MCP2515-I/SO; Mouser Price/Stock: https://www.mouser.co.uk/ProductDetail/Microchip-Technology/MCP2515-I-SO?qs=KwArPi4cUogGDbGnphOvtQ%3D%3D; Arrow Part Number: MCP2515-I/SO; Arrow Price/Stock: https://www.arrow.com/en/products/mcp2515-iso/microchip-technology?region=nac
R49-R54 = RES: as R20 on sheet Sheet2
Y1 = ECS-160-18-4X-CKM: Crystal or Oscillator; Manufacturer_Name: ECS; Datasheet Link: https://www.mouser.be/datasheet/2/122/hc-49usx-791.pdf; Height: 3.5mm; Manufacturer_Part_Number: ECS-160-18-4X-CKM; Mouser Part Number: 520-ECS160-18-4X-CKM; Mouser Price/Stock: https://www.mouser.co.uk/ProductDetail/ECS/ECS-160-18-4X-CKM?qs=7MVldsJ5UawYqyimirccKw%3D%3D

## Nets that join several sheets
+3V3: Sheet2 (C1.20 C1.38 R20.1), Sheet5 (R51.1 R52.1 R53.1 R54.1)
+5V: Sheet1 (9 pins), Sheet2 (C1.40), Sheet3 (8 pins), Sheet4 (6 pins), Sheet5 (5 pins)
+15V: Sheet1 (1.2 C4.1 IC1.7), Sheet2 (R27.2 R55.2), Sheet4 (J1.3 J1.4 J1.10 J1.26)
GND: Sheet1 (11 pins), Sheet2 (18 pins), Sheet3 (14 pins), Sheet4 (J1.31 J1.32 J2.12), Sheet5 (7 pins)
DIFF_N: Sheet4 (J1.41), Sheet5 (IC4.6 R49.1)
DIFF_P: Sheet4 (J1.45), Sheet5 (H6.1 IC4.7)
Net1_1: Sheet1 (1.1), Sheet4 (J1.1 J1.2 J2.14)
NetC1_10: Sheet2 (C1.10), Sheet5 (IC5.16 R51.2)
NetC1_11: Sheet2 (C1.11), Sheet5 (IC5.13 R54.2)
NetC1_12: Sheet2 (C1.12), Sheet5 (IC5.15 R52.2)
NetC1_13: Sheet2 (C1.13), Sheet5 (IC5.14 R53.2)
NetC1_15: Sheet2 (C1.15), Sheet4 (J1.35)
NetC1_28: Sheet2 (C1.28), Sheet3 (R37.1 R38.2)
NetC1_30: Sheet2 (C1.30), Sheet3 (D8.3 R40.2 R41.2)
NetC1_32: Sheet2 (C1.32), Sheet4 (J1.18)
NetD-1_1: Sheet2 (D-1.1 R21.2 R23.2), Sheet4 (J1.14)
NetD-2_1: Sheet2 (D-2.1 R31.2), Sheet4 (J1.21)
NetD-3_1: Sheet3 (D-3.1 R39.2), Sheet4 (J1.9 J1.25)
NetH2_1: Sheet2 (H2.1), Sheet3 (R43.1), Sheet4 (J1.43 J1.44)
NetIC2_1: Sheet2 (IC2.1 R27.1), Sheet4 (J1.13)
NetIC6_1: Sheet2 (IC6.1 R55.1), Sheet4 (J1.17)
NetJ1_22: Sheet2 (Q5.3), Sheet4 (J1.22)
NetJ1_24: Sheet2 (R26.2), Sheet4 (J1.24)
NetJ1_29: Sheet2 (Q8.3 R23.1), Sheet4 (J1.29)
NetJ1_33: Sheet3 (Q9.3), Sheet4 (J1.33)
NetJ1_34: Sheet2 (R12.2), Sheet4 (J1.34)
NetJ1_38: Sheet2 (R13.2), Sheet4 (J1.38)
NetJ1_39: Sheet2 (Q7.3 R13.1), Sheet4 (J1.39)
NetJ1_40: Sheet2 (Q6.3 R12.1), Sheet4 (J1.40)
NetJ1_42: Sheet3 (RN4.NC2), Sheet4 (J1.42 J2.9 J2.10)
NetJ1_46: Sheet3 (RN4.NO2), Sheet4 (J1.46 J1.48 J2.5 J2.6)
NetJ1_47: Sheet1 (R10.2), Sheet4 (J1.47)
NetJ1_49: Sheet3 (RN3.NO1), Sheet4 (J1.49)
NetJ1_50: Sheet1 (RN2.NO2), Sheet4 (J1.50)
NetJ1_52: Sheet1 (RN?.NC1), Sheet4 (J1.52)
NetJ1_53: Sheet1 (RN2.POLE2), Sheet4 (J1.53)
NetJ1_54: Sheet1 (R4.1 R5.2 R6.2), Sheet4 (J1.54)
NetJ1_55: Sheet1 (R8.2), Sheet4 (J1.55)
NetJ1_56: Sheet3 (R44.1 R45.2 R46.2), Sheet4 (J1.56)
NetJ2_2: Sheet3 (R44.2 RN4.POLE2), Sheet4 (J2.2 J2.8)
NetJ2_3: Sheet2 (R25.2), Sheet4 (J2.3 J2.4)
NetRN3_POLE1: Sheet1 (RN?.NO2), Sheet3 (RN3.POLE1)